# Altium schematic sheet Telemetry_Pi_Board.SchDoc
size 279 x 215 mm; SheetNumber: 2; SheetTotal: 10
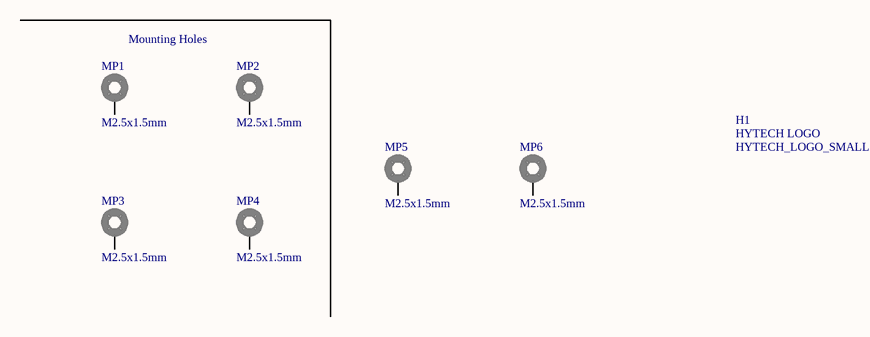
[diagram p0: Telemetry_Pi_Board.SchDoc]

## Parts
H1  HYTECH_LOGO_SMALL  [LOGO-HYTECH-SMALL]
MP1  M2.5x1.5mm  [9774015151]
MP2  M2.5x1.5mm  [9774015151]
MP3  M2.5x1.5mm  [9774015151]
MP4  M2.5x1.5mm  [9774015151]
MP5  M2.5x1.5mm  [9774015151]
MP6  M2.5x1.5mm  [9774015151]

## Nets

Not connected (* = marked no-connect by the designer): MP1 1; MP2 1; MP3 1; MP4 1; MP5 1; MP6 1

## Notes on the sheet
- Mounting Holes
- (in symbol HYTECH_LOGO_SMALL) HYTECH LOGO

## Library data of the parts
MP1-MP6 = 9774015151: WA-SMSI SMT Steel Spacer, M2.5 Thread Internal, OD 5.1mm, M2.5x1.5mm; Manufacturer: Wurth Elektronik; Inner Diameter: 3.5mm; Surface: Tin; ComponentLink1Description: Manufacturer; ComponentLink1URL: http://www.we-online.de; ComponentLink2Description: Datasheet; ComponentLink2URL: https://www.we-online.com/catalog/datasheet/9774015151.pdf; Mounting Technology: SMT; Packaging: Bulk; Length: 1.5mm; Inner Thread Length: -; Operating Temperature: -55 to +150degC; Outer Diameter: 5.1mm; Published Date: April 2020; Material: Steel; Thread: M2.5; MPN: 9774015151; MFR: Wurth Elektronik
H1 = HYTECH_LOGO_SMALL: MPN: -; MFR: -